# EAGLE design amiga2gameport_fett (EAGLE 5.07)
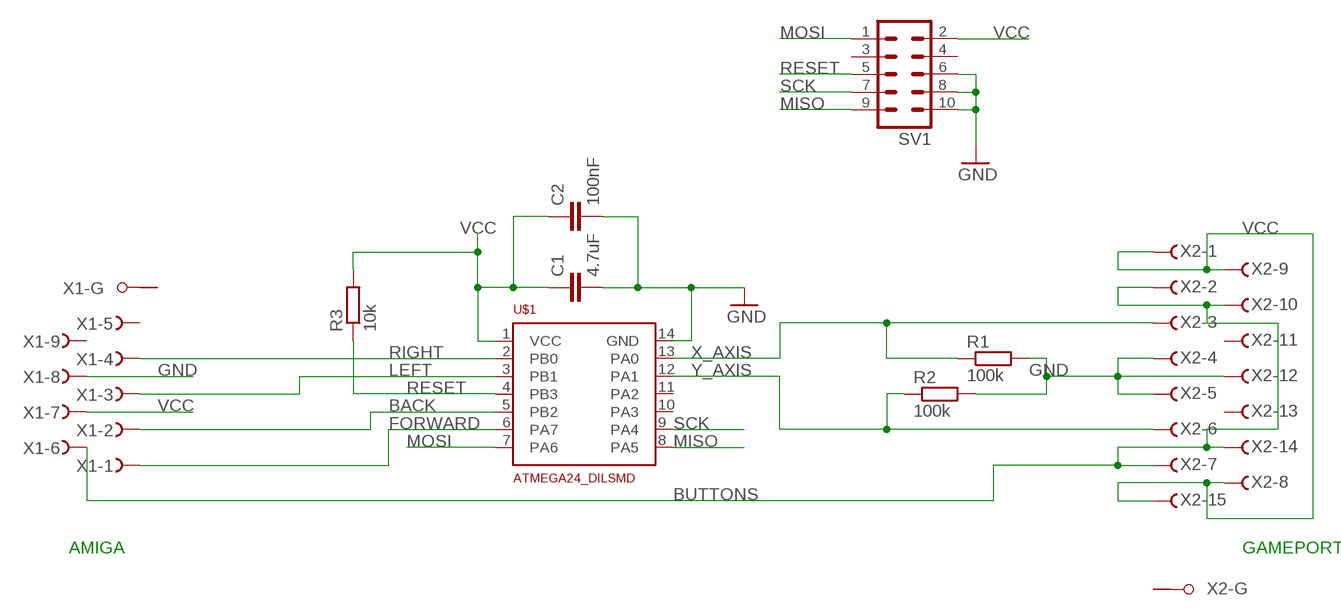
[diagram p0: schematic, sheet 1]

## Parts
C1  4.7uF  C-EUC1206  [C1206]
C2  100nF  C-EUC1206  [C1206]
R1  100k  R-EU_R1206  [R1206]
R2  100k  R-EU_M1206  [M1206]
R3  10k  R-EU_R1206  [R1206]
SV1  MA05-2  [MA05-2]
U$1  ATMEGA24_DILSMD  [SO14]
X1  F09HPS  [F09HP]
X2  F15HPS  [F15HP]

## Nets
BACK: U$1.5(PB2) X1.2(-2:F)
BUTTONS: X1.6(-6:F) X2.2(-2:F) X2.7(-7:F) X2.10(-10:F) X2.14(-14:F)
FORWARD: U$1.6(PA7) X1.1(-1:F)
GND: C1.2 C2.2 R1.2 R2.2 SV1.6 SV1.8 SV1.10 U$1.14(GND) X1.8(-8:F) X2.4(-4:F) X2.5(-5:F) X2.12(-12:F)
LEFT: U$1.3(PB1) X1.3(-3:F)
MISO: SV1.9 U$1.8(PA5)
MOSI: SV1.1 U$1.7(PA6)
RESET: R3.1 SV1.5 U$1.4(PB3)
RIGHT: U$1.2(PB0) X1.4(-4:F)
SCK: SV1.7 U$1.9(PA4)
VCC: C1.1 C2.1 R3.2 SV1.2 U$1.1(VCC) X1.7(-7:F) X2.1(-1:F) X2.8(-8:F) X2.9(-9:F) X2.15(-15:F)
X_AXIS: R1.1 U$1.13(PA0) X2.3(-3:F)
Y_AXIS: R2.1 U$1.12(PA1) X2.6(-6:F)
Unconnected: SV1.3 SV1.4 U$1.10(PA3) U$1.11(PA2) X1.5(-5:F) X1.9(-9:F) X1.G1(-G:G1) X1.G2(-G:G2) X2.11(-11:F) X2.13(-13:F) X2.G1(-G:G1) X2.G2(-G:G2)

## Notes on the sheet
- AMIGA | GAMEPORT

## Library data of the parts
C1 C2 = rcl:C-EU: CAPACITOR, European symbol
R1-R3 = rcl:R-EU_: RESISTOR, European symbol
SV1 = wannenstecker:MA05-2: PIN HEADER
U$1 = atmel:ATMEGA24_DIL
X1 = con-subd:F09HPS: SUB-D
X2 = con-subd:F15HPS: SUB-D

## Board
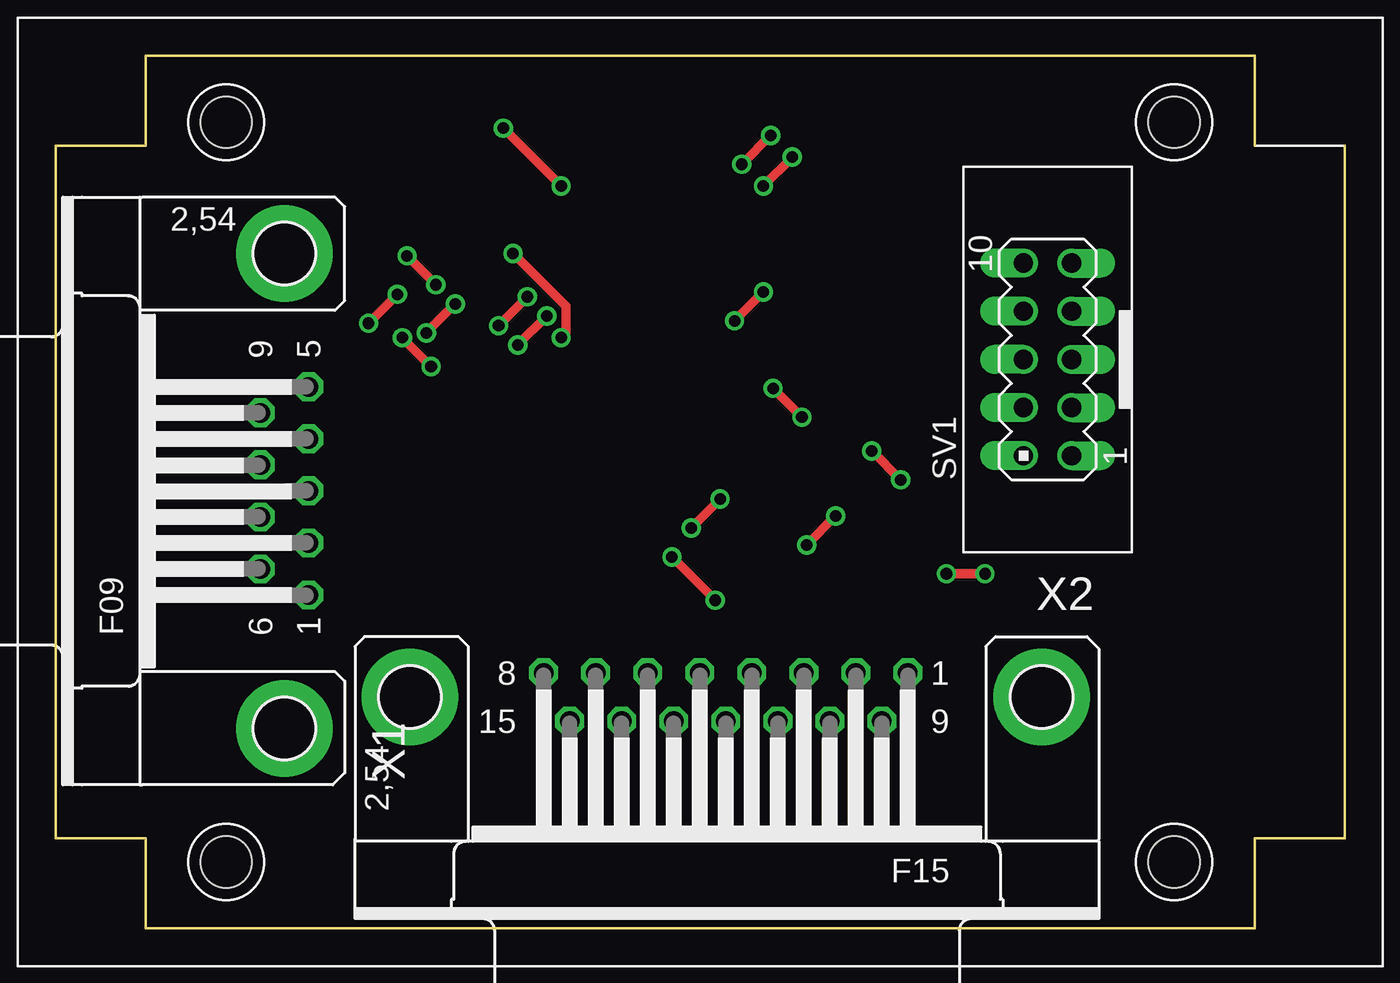
[diagram p1: board, top side]
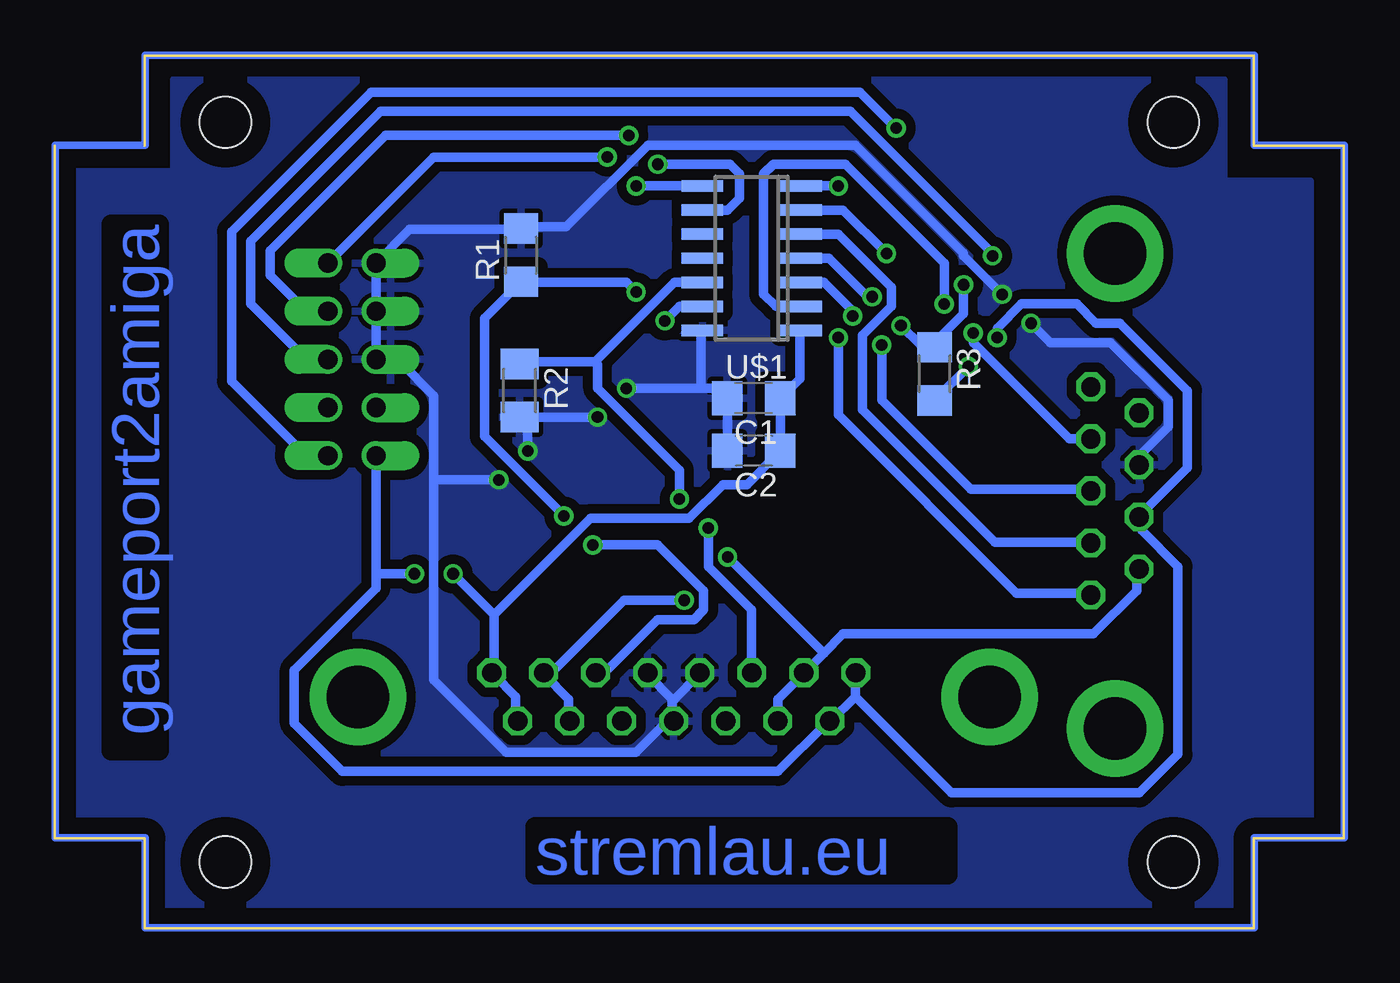
[diagram p2: board, bottom side, seen from below]

Size 68 x 46 mm. Coordinates in mm from the lower left corner, seen from the top.
Copper layers (1*16): Top 0.035mm / dielectric 1.5mm / Bottom 0.035mm
Design rules "default *": minimum track width 20mil, minimum drill 24mil, track to track 20mil, track to pad 20mil, pad to pad 15mil, via to via 10mil, smd to smd 8mil, copper to edge 40mil, drill to drill 8mil, minimum pad ring 10mil, minimum via ring 8mil, stop-mask expansion 4mil, vias tented up to drill 0mil, thermal gap 10mil
tRestrict: area -0.5,-1.2 to 16,39.1; area 47.5,19.3 to 57.1,40.7; area 15.5,1 to 55.1,16.8; area 42.2,32.8 to 44.7,38.1; area 41.9,25.7 to 45,30.8; area 27.2,30 to 35.3,40.4; area 28.4,23.9 to 33.8,29.2; area 20.6,26.4 to 22.6,32

### Footprints (pad centres in the part's own frame; a part is rotated, then mirrored left to right if it is on the bottom)
C1206 = smd 1.6 x 1.8: 1 -1.4,0; 2 1.4,0
R1206 = smd 1.6 x 1.8: 1 -1.4,0; 2 1.4,0
M1206 = smd 1.6 x 2: 1 -1.4,0; 2 1.4,0
MA05-2 = drill 1.016 offset: 1 -5.08,-1.27; 2 -5.08,1.27; 3 -2.54,-1.27; 4 -2.54,1.27; 5 0,-1.27; 6 0,1.27; 7 2.54,-1.27; 8 2.54,1.27; 9 5.08,-1.27; 10 5.08,1.27
SO14 = smd 0.6 x 2.2: 1 -3.81,-2.6; 2 -2.54,-2.6; 3 -1.27,-2.6; 4 0,-2.6; 5 1.27,-2.6; 6 2.54,-2.6; 7 3.81,-2.6; 8 3.81,2.6; 9 2.54,2.6; 10 1.27,2.6; 11 0,2.6; 12 -1.27,2.6; 13 -2.54,2.6; 14 -3.81,2.6
G028 = hole 2.7: 9,-3.5; 59,-3.5; 9,-42.5; 59,-42.5
F09HP = drill 1.016 octagon: 1 -5.486,-1.27; 2 -2.743,-1.27; 3 0,-1.27; 4 2.743,-1.27; 5 5.486,-1.27; 6 -4.115,1.27; 7 -1.372,1.27; 8 1.372,1.27; 9 4.115,1.27 | drill 3.302 pad 5.08 round: G1 -12.522,0; G2 12.522,0
F15HP = drill 1.016 octagon: 1 -9.601,-1.27; 2 -6.858,-1.27; 3 -4.115,-1.27; 4 -1.372,-1.27; 5 1.372,-1.27; 6 4.115,-1.27; 7 6.858,-1.27; 8 9.601,-1.27; 9 -8.23,1.27; 10 -5.486,1.27; 11 -2.743,1.27; 12 0,1.27; 13 2.743,1.27; 14 5.486,1.27; 15 8.23,1.27 | drill 3.302 pad 5.08 round: G1 -16.662,0; G2 16.662,0

### Placement (x,y rotation side)
C1  31.14,27.95 180 bottom
C2  31.13,25.18 180 bottom
R1  43.41,35.49 90 bottom
R2  43.48,28.36 270 bottom
R3  21.59,29.24 270 bottom
SV1  52.32,30 90 top
U$1  31.24,35.33 90 bottom
U$2  [G028]  0,46 0 top
X1  12.08,23.06 90 top
X2  35.35,12.2 180 top

### Tracks (layer width: path | path; a pad name or v marks a point on that pad's centre or on a via)
BACK
  Bottom 0.508: U$1.5 26.67,36.6 23.88,33.81 23.88,32.79 25.4,31.27 25.4,27.33 18.41,20.35 13.46,20.35 X1.2
BUTTONS  (via drill 0.61)
  Top 0.508: v32.51,19.58 v34.8,17.3
  Bottom 0.508: X2.10 40.89,10.95 40.89,12.09 42.16,13.36 X2.2 41.91,13.36 37.97,17.3 v34.8,17.3 | X2.14 29.84,10.95 29.84,12.09 28.57,13.36 X2.7 28.32,13.61 27.43,14.5 | 27.43,14.5 26.42,15.52 13.21,15.52 10.92,17.81 10.92,18.82 X1.6 | 27.43,14.5 v32.51,19.58
FORWARD  (via drill 0.61)
  Top 0.508: v24.13,35.59 26.92,32.79 26.92,31.39 v26.67,31.14
  Bottom 0.508: v24.13,35.59 26.42,37.87 U$1.6 | v26.67,31.14 26.67,27.08 17.27,17.68 13.46,17.68 X1.1
GND  (via drill 0.61)
  Top 0.508: v39.37,26.95 v37.85,28.47 | v16.51,31.9 v18.03,33.43 | v44.58,23.65 v43.05,25.17
  Bottom 0.508: C2.2 32.51,25.3 32.51,27.84 C1.2 32.77,27.97 33.27,28.47 33.91,28.47 | v39.37,26.95 43.43,26.95 R2.2 43.05,26.82 v43.05,25.17 | v37.85,28.47 33.91,28.47 | U$1.14 33.91,31.52 33.91,28.47 | 35.43,12.09 35.43,10.95 X2.12 35.69,10.95 37.34,9.3 44.2,9.3 48.01,13.11 48.01,23.65 | 35.43,12.09 36.7,13.36 X2.4 | X2.5 34.04,13.36 35.31,12.09 35.43,12.09 | v16.51,31.9 15.49,30.89 12.32,30.89 9.27,27.84 9.27,26.44 10.79,24.92 10.79,24.54 X1.8 | v18.03,33.43 20.07,35.46 20.07,35.59 25.78,41.3 36.7,41.3 41.02,36.98 43.18,36.98 R1.2 43.43,36.86 49.28,36.86 SV1.10 SV1.8 SV1.6 50.93,29.87 49.78,29.87 48.01,28.09 48.01,23.65 | 48.01,23.65 v44.58,23.65
  pour Bottom: 1.78,39.4 6.35,39.4 6.35,44.73 61.72,44.73 61.72,42.19 61.72,39.9 66.55,39.9 67.06,39.9 67.06,5.61 62.23,5.61 62.23,0.79 1.78,0.79
LEFT  (via drill 0.61)
  Top 0.508: v24.38,30.76 v25.91,32.28
  Bottom 0.508: v25.91,32.28 25.91,32.54 27.43,34.06 U$1.3 | v24.38,30.76 24.38,27.84 19.68,23.14 13.46,23.14 X1.3
MISO  (via drill 0.61)
  Top 0.508: v37.34,39.14 v38.86,40.67
  Bottom 0.508: v38.86,40.67 48.01,40.67 SV1.9 | U$1.8 v37.34,39.14
MOSI  (via drill 0.61)
  Top 0.508: v23.62,42.19 v26.67,39.14
  Bottom 0.508: v23.62,42.19 25.53,44.09 51.31,44.09 58.67,36.73 58.67,28.85 54.74,24.92 SV1.1 | v26.67,39.14 U$1.7
N$2
  Bottom 0.406: 4.73,46.04 63.23,46.04 63.23,41.29 67.98,41.29 67.98,4.79 63.23,4.79 63.23,0.04 4.73,0.04 4.73,4.79 -0.02,4.79 -0.02,41.29 4.73,41.29 4.73,46.04
RESET  (via drill 0.61)
  Top 0.508: v23.37,31.78 v24.89,33.3 | v20.07,33.94 v18.54,35.46
  Bottom 0.508: v23.37,31.78 22.35,30.76 21.59,30.76 R3.1 21.59,30.89 20.07,32.41 v20.07,33.94 | v24.89,33.3 25.15,33.3 27.18,35.33 U$1.4 | SV1.5 54.74,30 57.66,32.92 57.66,36.22 50.8,43.08 26.04,43.08 18.54,35.59 v18.54,35.46
RIGHT  (via drill 0.61)
  Top 0.508: v19.56,31.39 v21.08,32.92
  Bottom 0.508: v21.08,32.92 21.08,35.08 26.29,40.28 30.1,40.28 30.61,39.78 30.61,33.43 29.97,32.79 U$1.2 | v19.56,31.39 19.56,30.89 14.48,25.81 13.46,25.81 X1.4
SCK  (via drill 0.61)
  Top 0.508: v36.2,40.28 v37.72,41.81
  Bottom 0.508: v36.2,40.28 32.38,40.28 31.88,39.78 31.88,38.51 32.51,37.87 U$1.9 | v37.72,41.81 50.55,41.81 56.64,35.71 56.64,34.44 54.74,32.54 SV1.7
VCC  (via drill 0.61)
  Top 0.508: v18.29,31.14 v19.81,29.62 | v49.02,18.7 v46.99,18.7
  Bottom 0.508: X2.9 43.69,10.95 43.69,12.22 44.83,13.36 X2.1 44.83,13.61 44.83,16.54 | U$1.1 28.7,31.52 28.7,28.98 29.59,28.09 C1.1 29.72,27.84 29.72,25.3 C2.1 29.84,25.05 31.5,23.39 32.77,23.39 34.54,21.62 39.75,21.62 44.83,16.54 | v19.81,29.62 R3.2 | v18.29,31.14 18.29,31.65 17.02,32.92 14.1,32.92 13.08,31.9 11.81,31.9 8.26,28.35 8.26,24.28 10.79,21.74 X1.7 10.67,21.49 10.67,20.98 8.76,19.08 8.76,9.17 10.79,7.14 20.7,7.14 25.78,12.22 | 25.78,12.22 25.78,13.36 X2.8 | 25.78,12.22 27.05,10.95 X2.15 27.3,10.82 29.84,8.28 52.83,8.28 55.37,10.82 55.37,13.61 51.05,17.93 51.05,18.7 | 51.05,18.7 SV1.2 | v46.99,18.7 44.83,16.54 | 51.05,18.7 v49.02,18.7
X_AXIS  (via drill 0.61)
  Top 0.508: v37.34,33.55 v35.81,32.03 | v39.62,20.22 v41.15,21.74
  Bottom 0.508: v37.34,33.55 37.85,34.06 43.31,34.06 R1.1 43.56,33.94 45.34,32.16 45.34,25.93 v41.15,21.74 | v35.81,32.03 35.05,32.79 U$1.13 | v39.62,20.22 36.2,20.22 33.78,17.81 33.78,16.79 34.29,16.28 36.2,16.28 38.99,13.49 39.37,13.49 X2.3
Y_AXIS  (via drill 0.61)
  Top 0.508: v33.53,21.11 v35.05,22.63
  Bottom 0.508: 39.5,29.87 43.43,29.87 R2.1 | 39.5,29.87 35.31,34.06 U$1.12 | v33.53,21.11 33.53,19.08 31.24,16.79 31.24,13.49 X2.6 | v35.05,22.63 35.05,24.16 39.37,28.47 39.37,29.74 39.5,29.87

### Text on the board
Bottom: gameport2amiga | stremlau.eu